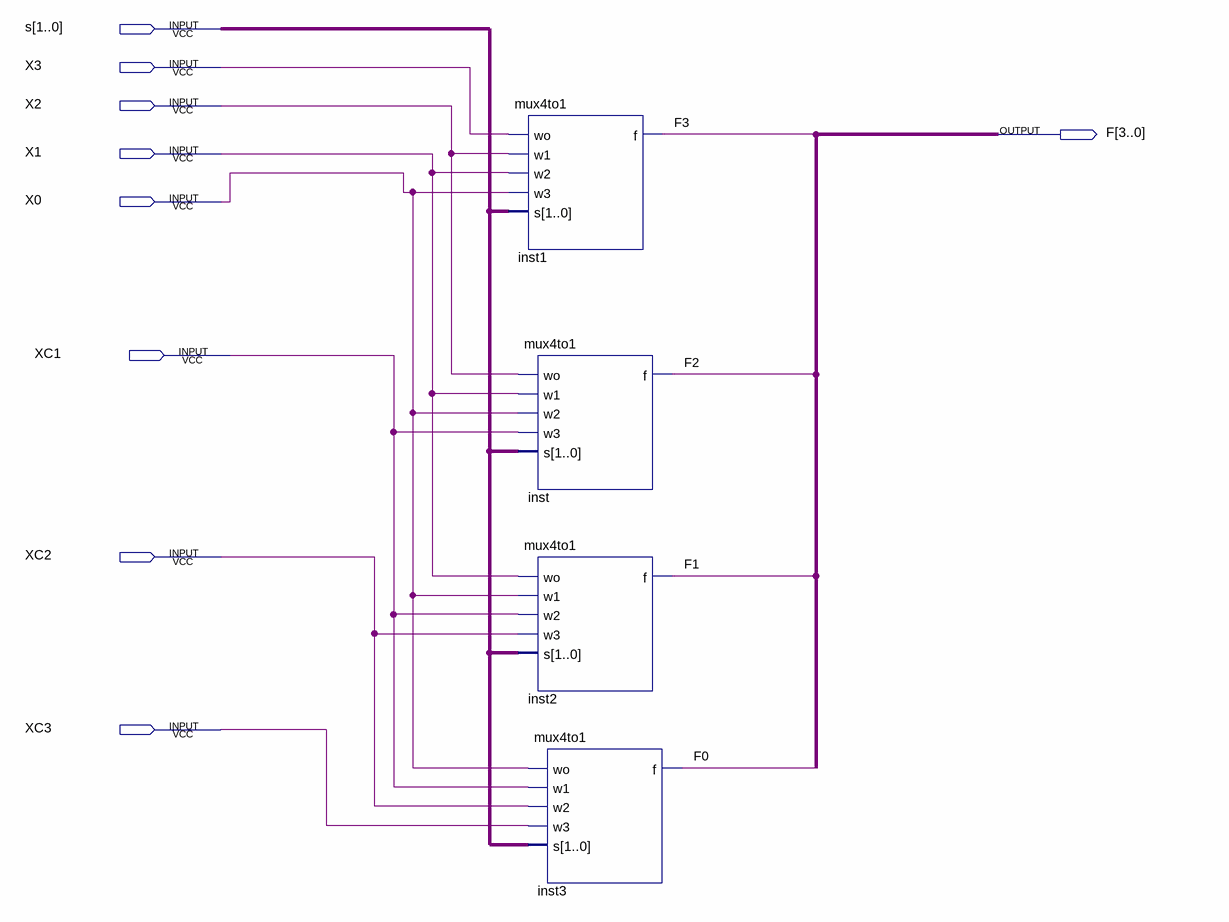
[diagram p0: schematic sheet]
// Quartus schematic lab8step2.bdf as structural Verilog: 4 symbols, 9 pins
module lab8step2 (
  input  [1:0] s,
  input  X3,
  input  X2,
  input  X1,
  input  X0,
  input  XC1,
  input  XC2,
  input  XC3,
  output [3:0] F
);

  mux4to1 inst1 (.wo(X3), .w1(X2), .w2(X1), .w3(X0), .s(s), .f(F[3]));
  mux4to1 inst (.wo(X2), .w1(X1), .w2(X0), .w3(XC1), .s(s), .f(F[2]));
  mux4to1 inst2 (.wo(X1), .w1(X0), .w2(XC1), .w3(XC2), .s(s), .f(F[1]));
  mux4to1 inst3 (.wo(X0), .w1(XC1), .w2(XC2), .w3(XC3), .s(s), .f(F[0]));
endmodule
